# Altium project MEMs_Breakout_Board.PrjPcb
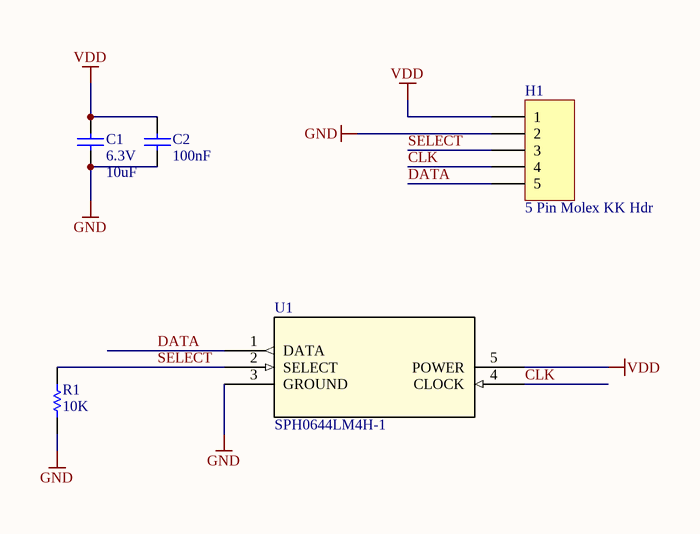
[diagram p0: MEMs_Breakout_Board.SchDoc]
1 sheet, 5 parts. Net scope: global (net labels, ports and power ports of the same name join across sheets).
Board file: MEMs_Breakout_Board.PcbDoc

## Sheet MEMs_Breakout_Board.SchDoc
size A4

### Parts
C1  Voltage - Rated: 6.3V  [CAPC1608L]  (hidden comment: 10uF)
C2  100nF  [CAPC1608L]
H1  5 Pin Molex KK Hdr  [MOLEX_KK_5_HDR]
R1  10K  [RESC1608L]
U1  SPH0644LM4H-1  [SPH0644LM4H-1_KNO]

### Nets
GND: C1.1 C2.1 H1.2 R1.1 U1.3(GROUND)
VDD: C1.2 C2.2 H1.1 U1.5(POWER)
CLK: H1.4 U1.4(CLOCK)
DATA: H1.5 U1.1(DATA)
SELECT: H1.3 R1.2 U1.2(SELECT)

### Library data of the parts
C1 = CC_10uF_0603: CAP CER 10UF X5R +-20% 6V3 0603; Supplier: ECE Dept; Storage Location: PCB Assembly WS; Value: 10uF
C2 = CC_100nF_0603: CAP CER 100nF X7R +-10% 50V 0603; PackageReference: 0603; Code_IPC: 1608 [0603]; Verify: *; Supplier: ECE Dept; Storage Location: PCB Assembly WS; Value: 100nF
H1 = JA_MOLEX_KK_5POS: CONN HEADER 5POS 2.54mm VERT_Thru Hole; Manufacturer: Molex; Manufacturer PN: 22-23-2051; Supplier Part Number 1: 9731679; Supplier: ECE Dept; Supplier 1: Farnell; Storage Location: ECE Dept Store; Value: 5 Pin Molex KK Hdr
R1 = RS_10K: RES 10.0K OHM 1/10W 5% 0603 SMD; Storage Location: PCB Assembly WS; Supplier: ECE Dept; Value: 10K
U1 = SPH0644LM4H-1: No Description Available; Built_By: EMA_Cory; Vendor: Knowles; SourceLibrary: Knowles_2019-12-03; Copyright: Copyright (C) 2018 Accelerated Designs. All rights reserved; Manufacturer_Part_Number: SPH0644LM4H-1; RefDes: RefDes; Type: DEV